# EAGLE design LEDs3 (EAGLE 6.3)
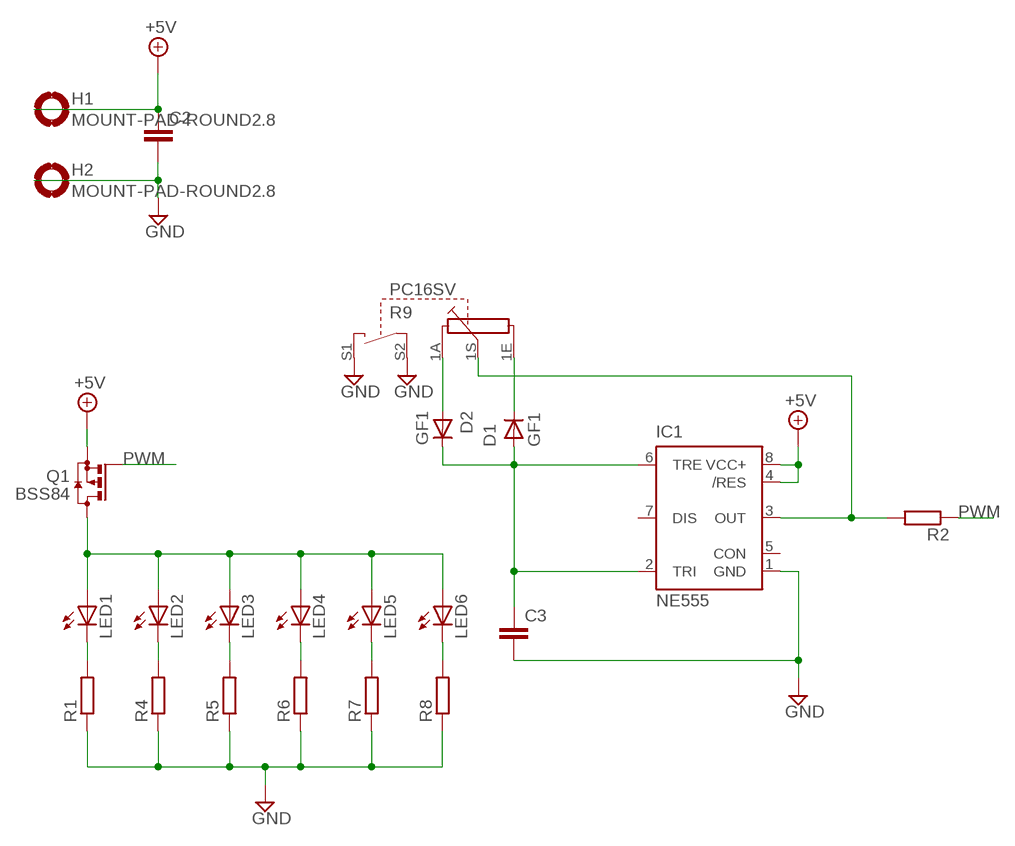
[diagram p0: schematic, sheet 1]

## Parts
C2  C-EUC1206K  [C1206K]
C3  C-EUC0805  [C0805]
D1  GF1  [SMA-DO214AC]
D2  GF1  [SMA-DO214AC]
H1  MOUNT-PAD-ROUND2.8  [2,8-PAD]
H2  MOUNT-PAD-ROUND2.8  [2,8-PAD]
IC1  NE555  [DIL-08]
LED1  LED-2AC-CP41B-WES  [CP41B]
LED2  LED-2AC-CP41B-WES  [CP41B]
LED3  LED-2AC-CP41B-WES  [CP41B]
LED4  LED-2AC-CP41B-WES  [CP41B]
LED5  LED-2AC-CP41B-WES  [CP41B]
LED6  LED-2AC-CP41B-WES  [CP41B]
Q1  BSS84  [SOT23]
R1  R-EU_M0805  [M0805]
R2  R-EU_M0805  [M0805]
R4  R-EU_M0805  [M0805]
R5  R-EU_M0805  [M0805]
R6  R-EU_M0805  [M0805]
R7  R-EU_M0805  [M0805]
R8  R-EU_M0805  [M0805]
R9  PC16SV  [PC16SV]

## Nets
+5V: C2.1 H1.B2,8(MOUNT) IC1.4(/RES) IC1.8(VCC+) Q1.2(S)
GND: C2.2 C3.2 H2.B2,8(MOUNT) IC1.1(GND) R1.1 R4.1 R5.1 R6.1 R7.1 R8.1 R9.S1 R9.S2
N$1: IC1.3(OUT) R2.2 R9.1S
N$3: D2.A R9.1A
N$4: D1.K(C) R9.1E
N$7: LED1.2(A) LED1.3(A) LED2.2(A) LED2.3(A) LED3.2(A) LED3.3(A) LED4.2(A) LED4.3(A) LED5.2(A) LED5.3(A) LED6.2(A) LED6.3(A) Q1.3(D)
N$8: LED1.1(C) LED1.4(C) R1.2
N$9: LED2.1(C) LED2.4(C) R4.2
N$10: LED3.1(C) LED3.4(C) R5.2
N$11: LED4.1(C) LED4.4(C) R6.2
N$12: LED5.1(C) LED5.4(C) R7.2
N$13: LED6.1(C) LED6.4(C) R8.2
N$15: C3.1 D1.A D2.K(C) IC1.2(TRI) IC1.6(TRE)
PWM: Q1.1(G) R2.1
Unconnected: IC1.5(CON) IC1.7(DIS)

## Library data of the parts
C2 C3 = rcl:C-EU: CAPACITOR, European symbol
D1 D2 = diode:GF1: DIODE
H1 H2 = holes:MOUNT-PAD-ROUND: MOUNTING PAD, round
IC1 = st-microelectronics:NE555: General purpose bipolar Timer; MF: Arrow Electronics; MPN: NE555N; OC_FARNELL: 1467742; OC_NEWARK: 89K1486
LED1-LED6 = led:LED-2AC-: LEDs with 2 Cathode & 2 Anode - Kingbright SUPER FLUX LED LAMP Source: www.us.kingbright.com/images/catalog/SPEC/W7676CPBC-H.pdf Cree® P4 LED CP41B-WES/WGS Source: Data sheet <http://www.cree.com/products/pdf/LEDlamps/CP41B-WES&WGS.pdf>
Q1 = transistor-small-signal:BSS84: P-CHANNEL MOS FET
R1 R2 R4-R8 = resistor:R-EU_: RESISTOR, European symbol
R9 = piher:PC16SV: POTENTIOMETER vertical single carbon potentiometer with switch, 16 mm; OC_FARNELL: unknown; OC_NEWARK: unknown

## Board
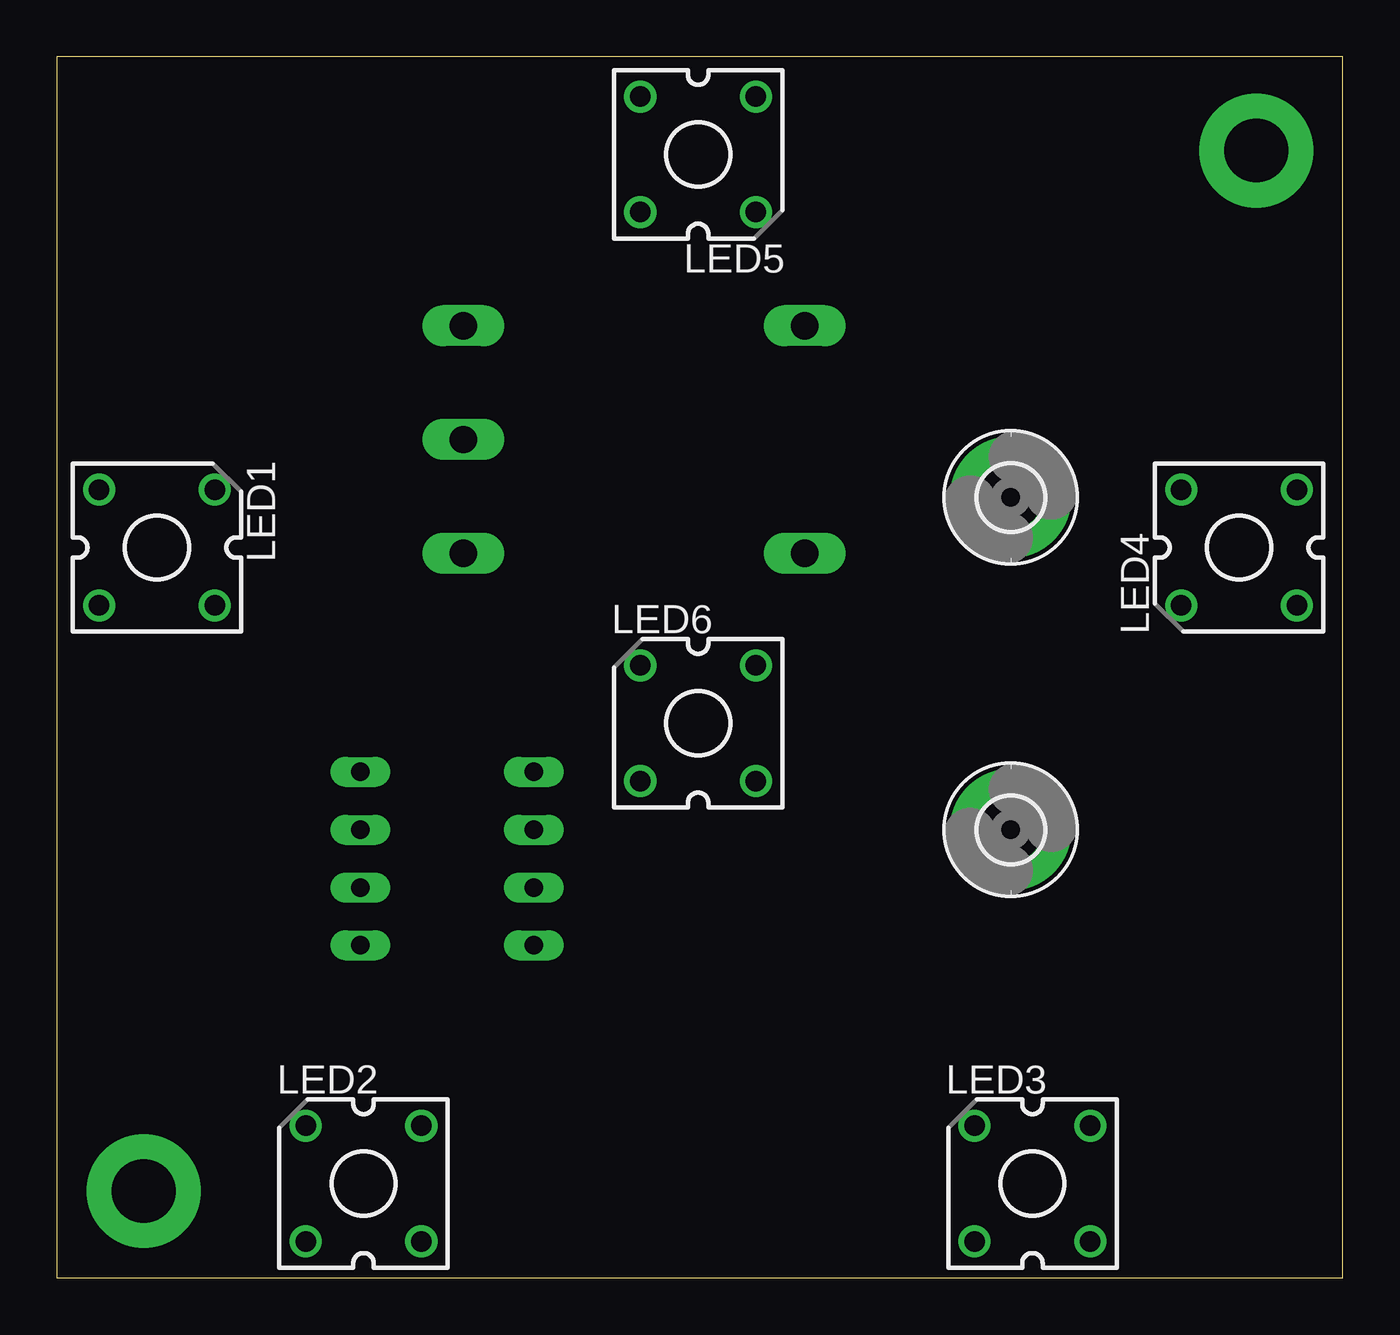
[diagram p1: board, top side]
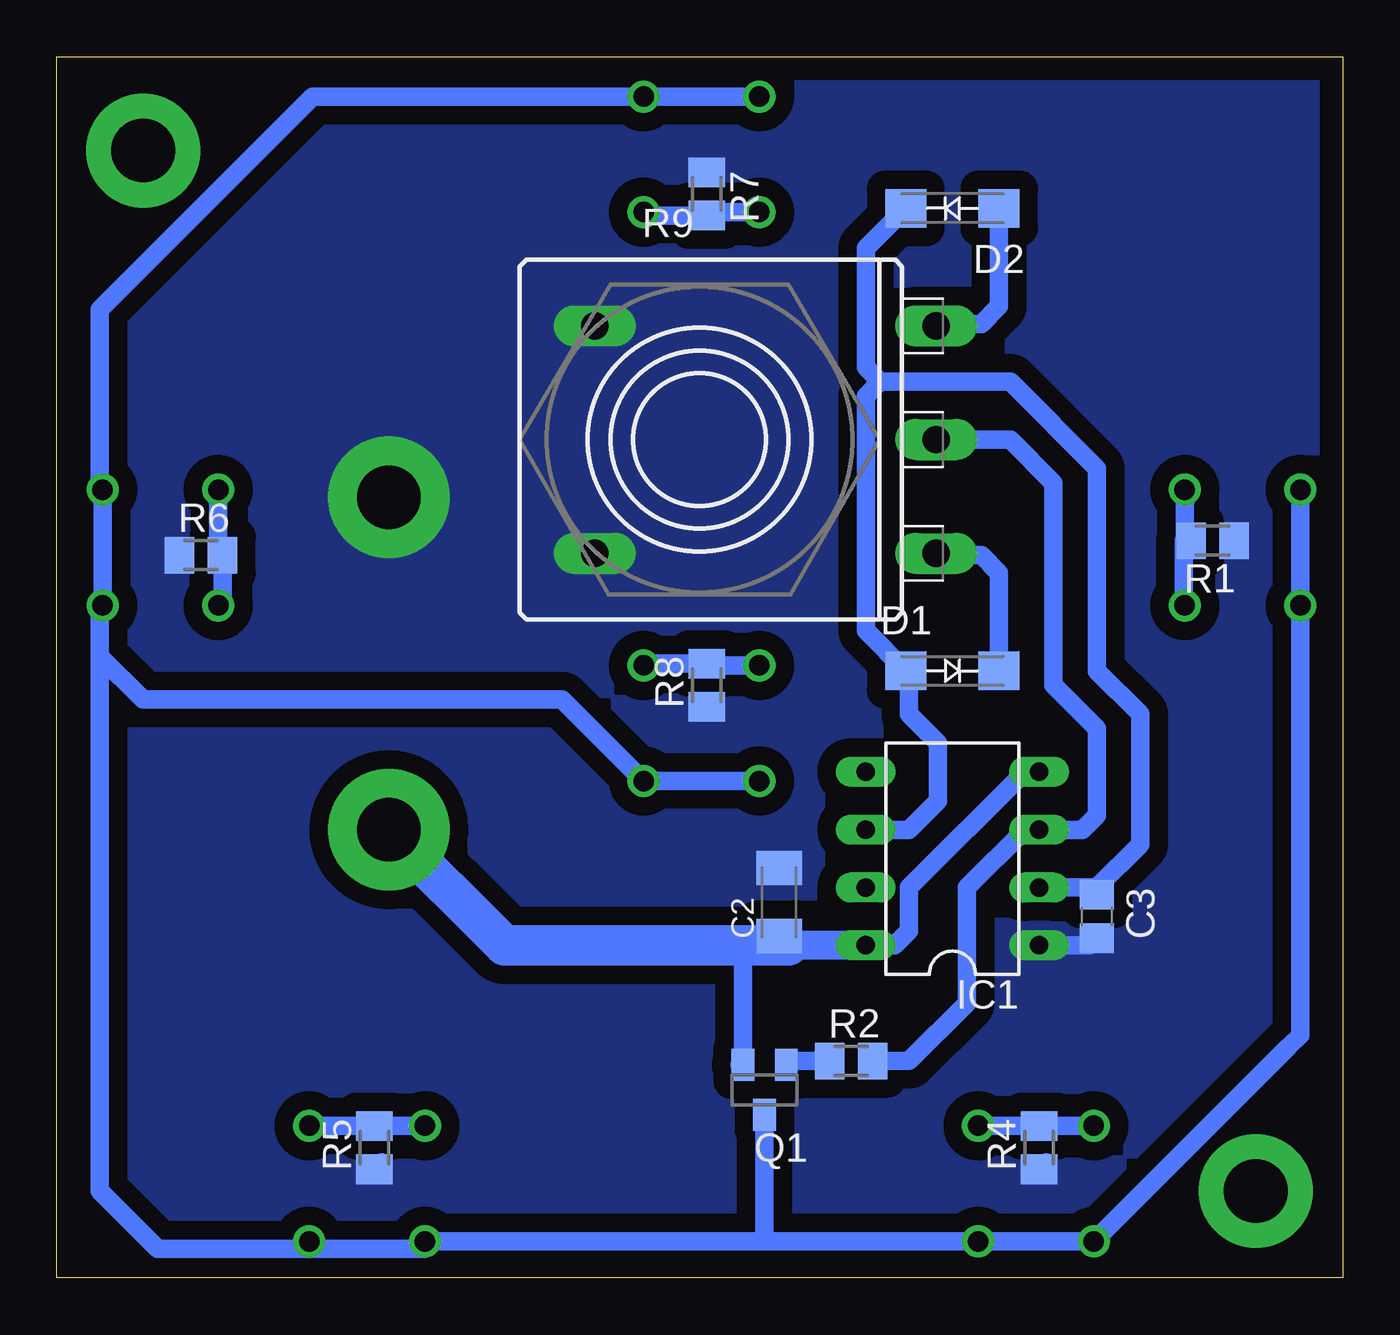
[diagram p2: board, bottom side, seen from below]

Size 56.49 x 53.65 mm. Coordinates in mm from the lower left corner, seen from the top.
Outline: 0,0 56.49,0 56.49,53.65 0,53.65 0,0
Copper layers (1*16): Top 0.035mm / dielectric 1.5mm / Bottom 0.035mm
Design rules "default": minimum track width 10mil, minimum drill 24mil, track to track 8mil, track to pad 8mil, pad to pad 8mil, via to via 8mil, smd to smd 8mil, copper to edge 40mil, drill to drill 8mil, minimum pad ring 10mil, minimum via ring 8mil, stop-mask expansion 4mil, vias tented up to drill 0mil, thermal gap 10mil
bRestrict: area 16.5,16.5 to 19.7,19.7; 1 lines

### Footprints (pad centres in the part's own frame; a part is rotated, then mirrored left to right if it is on the bottom)
C1206K = smd 1.5 x 2: 1 -1.5,0; 2 1.5,0
C0805 = smd 1.3 x 1.5: 1 -0.95,0; 2 0.95,0
SMA-DO214AC = smd 1.8 x 1.7: A -2.05,0; K 2.05,0
2,8-PAD = drill 2.8 pad 5.334: B2,8 0,0
DIL-08 = drill 0.813 long: 1 -3.81,-3.81; 2 -1.27,-3.81; 3 1.27,-3.81; 4 3.81,-3.81; 5 3.81,3.81; 6 1.27,3.81; 7 -1.27,3.81; 8 -3.81,3.81
CP41B = drill 0.9 pad 1.27: 1 -2.54,2.54; 2 -2.54,-2.54; 3 2.54,-2.54; 4 2.54,2.54
SOT23 = smd 1 x 1.4: 1 -0.95,-1.1; 2 0.95,-1.1; 3 0,1.1
M0805 = smd 1.3 x 1.6: 1 -0.95,0; 2 0.95,0
PC16SV = drill 1.2 long: 1A -5,10.4; 1E 5,10.4; 1S 0,10.4; S1 -5,-4.6; S2 5,-4.6

### Placement (x,y rotation side)
C2  24.77,16.51 90 bottom
C3  10.79,15.88 270 bottom
D1  17.14,26.67 0 bottom
D2  17.14,46.99 180 bottom
H1  41.91,19.68 0 top
H2  41.91,34.29 0 top
IC1  17.14,18.41 90 bottom
LED1  4.39,32.09 270 top
LED2  13.47,4.13 0 top
LED3  42.87,4.13 0 top
LED4  51.95,32.09 90 top
LED5  28.18,49.37 180 top
LED6  28.18,24.36 0 top
Q1  25.4,8.26 180 bottom
R1  5.71,32.38 180 bottom
R2  21.59,9.53 0 bottom
R4  13.34,5.71 90 bottom
R5  42.55,5.71 90 bottom
R6  50.16,31.75 0 bottom
R7  27.94,47.62 270 bottom
R8  27.94,26.04 90 bottom
R9  28.26,36.83 270 bottom

### Tracks (layer width: path | path; a pad name or v marks a point on that pad's centre or on a via)
+5V
  Bottom 0.813: IC1.8 19.68,14.61 19.05,15.24 19.05,17.14 13.97,22.23 IC1.4 | 26.5,9.36 Q1.2 26.35,14.29 26.04,14.61
  Bottom 1.27: IC1.8 24.36,14.61 C2.1
  Bottom 1.778: H1.B2,8 36.83,14.61 26.04,14.61 24.36,14.61
GND
  Bottom 0.813: 13.02,5.08 R4.1 | 42.23,5.08 R5.1 | IC1.1 11.12,14.61 C3.2
  pour Bottom (isolate 0.813, no thermals): 0,53.98 56.52,53.98 56.52,0 0,0
N$1
  Bottom 0.813: R2.2 19.05,9.53 16.51,12.06 16.51,17.14 13.97,19.68 IC1.3 11.43,19.68 10.79,20.32 10.79,24.13 12.7,26.04 12.7,34.92 14.61,36.83 R9.1S
N$3
  Bottom 0.813: D2.A 15.1,42.69 15.88,41.91 17.78,41.91 R9.1A
N$4
  Bottom 0.813: D1.K 15.1,30.97 15.88,31.75 17.78,31.75 R9.1E
N$7
  Bottom 0.813: LED5.3 LED5.2 45.25,51.91 54.61,42.55 54.61,34.75 LED4.3 LED4.2 54.61,29.55 54.61,27.3 | 54.61,27.3 54.61,3.81 52.07,1.27 45.41,1.27 | 45.41,1.27 LED3.3 | 45.41,1.27 40.33,1.27 LED3.2 25.4,1.59 | 25.4,1.59 LED2.3 LED2.2 2.35,10.16 1.85,10.66 LED1.3 LED1.2 | LED6.2 LED6.3 34.29,25.4 52.7,25.4 54.61,27.3 | Q1.3 25.4,1.59
N$8
  Bottom 0.813: LED1.1 6.93,32.44 | 6.93,32.44 6.99,32.38 6.99,29.59 LED1.4 | R1.2 6.88,32.38 6.93,32.44
N$9
  Bottom 0.813: LED2.1 13.32,6.67 R4.2 16,6.67 LED2.4
N$10
  Bottom 0.813: LED3.1 42.53,6.67 R5.2 45.4,6.67 LED3.4
N$11
  Bottom 0.813: LED4.4 49.41,31.94 R6.2 49.22,29.73 LED4.1
N$12
  Bottom 0.813: LED5.4 27.79,46.83 R7.2 30.57,46.67 LED5.1
N$13
  Bottom 0.813: LED6.1 27.94,26.91 R8.2 30.71,26.98 LED6.4
N$15
  Bottom 0.813: IC1.6 19.05,19.68 17.78,20.95 17.78,23.5 19.05,24.77 19.05,26.52 D1.A 20.95,28.43 20.95,38.73 20.32,39.37 | 11.12,17.14 C3.1 | IC1.2 11.12,17.14 | 11.12,17.14 10.79,17.14 8.89,19.05 8.89,24.77 10.79,26.67 10.79,35.56 14.61,39.37 20.32,39.37 | 19.05,47.13 D2.K 20.95,45.23 20.95,40.01 20.32,39.37
N$16  (via drill 2.8 pad 5)
  other vias: 3.81,3.81
N$17  (via drill 2.8 pad 5)
  other vias: 52.7,49.53
PWM
  Bottom 0.813: R2.1 24.28,9.53 Q1.1